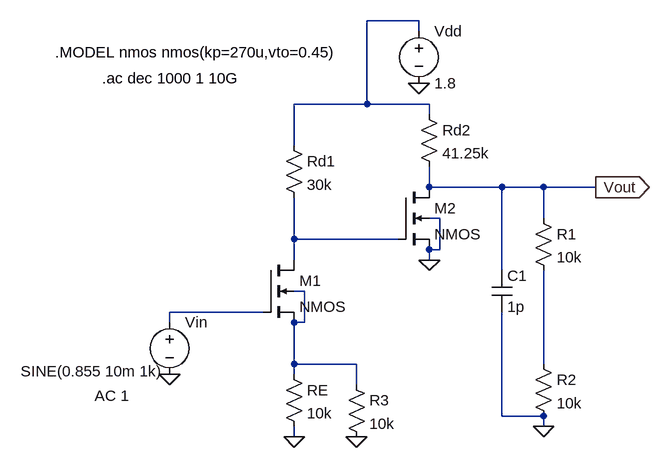
[diagram p0: schematic feedback-openloop.asc]
feedback-openloop.asc, the LTspice schematic file:
Version 4
SHEET 1 880 680
WIRE 336 -208 256 -208
WIRE 336 -192 336 -208
WIRE 256 -80 256 -208
WIRE 256 -80 144 -80
WIRE 352 -80 256 -80
WIRE 352 -64 352 -80
WIRE 144 -16 144 -80
WIRE 352 48 352 16
WIRE 464 48 352 48
WIRE 528 48 464 48
WIRE 608 48 528 48
WIRE 368 96 352 96
WIRE 528 96 528 48
WIRE 144 128 144 64
WIRE 304 128 144 128
WIRE 368 144 368 96
WIRE 368 144 352 144
WIRE 144 160 144 128
WIRE 352 160 352 144
WIRE 464 176 464 48
WIRE 160 208 144 208
WIRE 96 240 -48 240
WIRE -48 256 -48 240
WIRE 160 256 160 208
WIRE 160 256 144 256
WIRE 144 320 144 256
WIRE 240 320 144 320
WIRE 528 320 528 176
WIRE 144 336 144 320
WIRE 240 352 240 320
WIRE 464 400 464 240
WIRE 528 400 464 400
WIRE 528 416 528 400
WIRE 144 432 144 416
FLAG 528 416 0
FLAG 352 160 0
FLAG -48 336 0
FLAG 336 -112 0
FLAG 608 48 Vout
IOPIN 608 48 Out
FLAG 144 432 0
FLAG 240 432 0
SYMBOL res 128 -32 R0
SYMATTR InstName Rd1
SYMATTR Value 30k
SYMBOL res 336 -80 R0
SYMATTR InstName Rd2
SYMATTR Value 41.25k
SYMBOL res 512 80 R0
SYMATTR InstName R1
SYMATTR Value 10k
SYMBOL res 512 304 R0
SYMATTR InstName R2
SYMATTR Value 10k
SYMBOL voltage 336 -208 R0
WINDOW 123 0 0 Left 2
WINDOW 39 0 0 Left 2
SYMATTR InstName Vdd
SYMATTR Value 1.8
SYMBOL voltage -48 240 R0
WINDOW 3 -229 91 Left 2
WINDOW 123 -115 129 Left 2
WINDOW 39 0 0 Left 2
SYMATTR Value SINE(0.855 10m 1k)
SYMATTR Value2 AC 1
SYMATTR InstName Vin
SYMBOL res 128 320 R0
SYMATTR InstName RE
SYMATTR Value 10k
SYMBOL res 224 336 R0
SYMATTR InstName R3
SYMATTR Value 10k
SYMBOL cap 448 176 R0
SYMATTR InstName C1
SYMATTR Value 1p
SYMBOL nmos4 96 160 R0
SYMATTR InstName M1
SYMATTR Value2 l=0.18u w=1.333u
SYMBOL nmos4 304 48 R0
SYMATTR InstName M2
SYMATTR Value2 l=0.18u w=2.148u
TEXT -152 -120 Left 2 !.ac dec 1000 1 10G
TEXT -224 -160 Left 2 !.MODEL nmos nmos(kp=270u,vto=0.45)

The netlist it stands for:
* feedback-openloop.asc
Rd1 N001 N002 30k
Rd2 N001 Vout 41.25k
R1 Vout N005 10k
R2 N005 0 10k
Vdd N001 0 1.8
Vin N004 0 SINE(0.855 10m 1k) AC 1
RE N003 0 10k
R3 N003 0 10k
C1 Vout 0 1p
M1 N002 N004 N003 N003 NMOS l=0.18u w=1.333u
M2 Vout N002 0 0 NMOS l=0.18u w=2.148u
.model NMOS NMOS
.model PMOS PMOS
.lib standard.mos
.ac dec 1000 1 10G
.MODEL nmos nmos(kp=270u,vto=0.45)
.backanno
.end